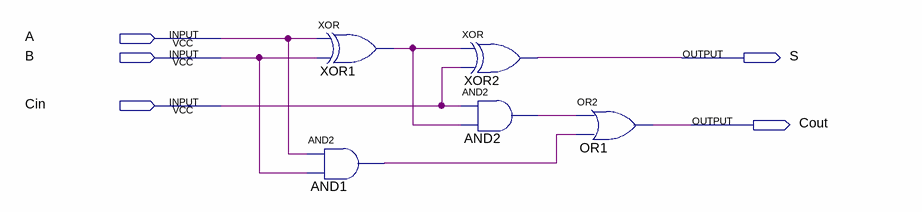
[diagram p0: schematic sheet]
// Quartus schematic FA.bdf as structural Verilog: 5 symbols, 5 pins
module FA (
  input  A,
  input  B,
  input  Cin,
  output S,
  output Cout
);

  wire AND1_out, AND2_out, XOR1_out;

  xor XOR1 (XOR1_out, A, B);
  and AND1 (AND1_out, A, B);
  xor XOR2 (S, XOR1_out, Cin);
  and AND2 (AND2_out, Cin, XOR1_out);
  or OR1 (Cout, AND2_out, AND1_out);
endmodule
